# EAGLE design interface2kempston (EAGLE 7.3.0)
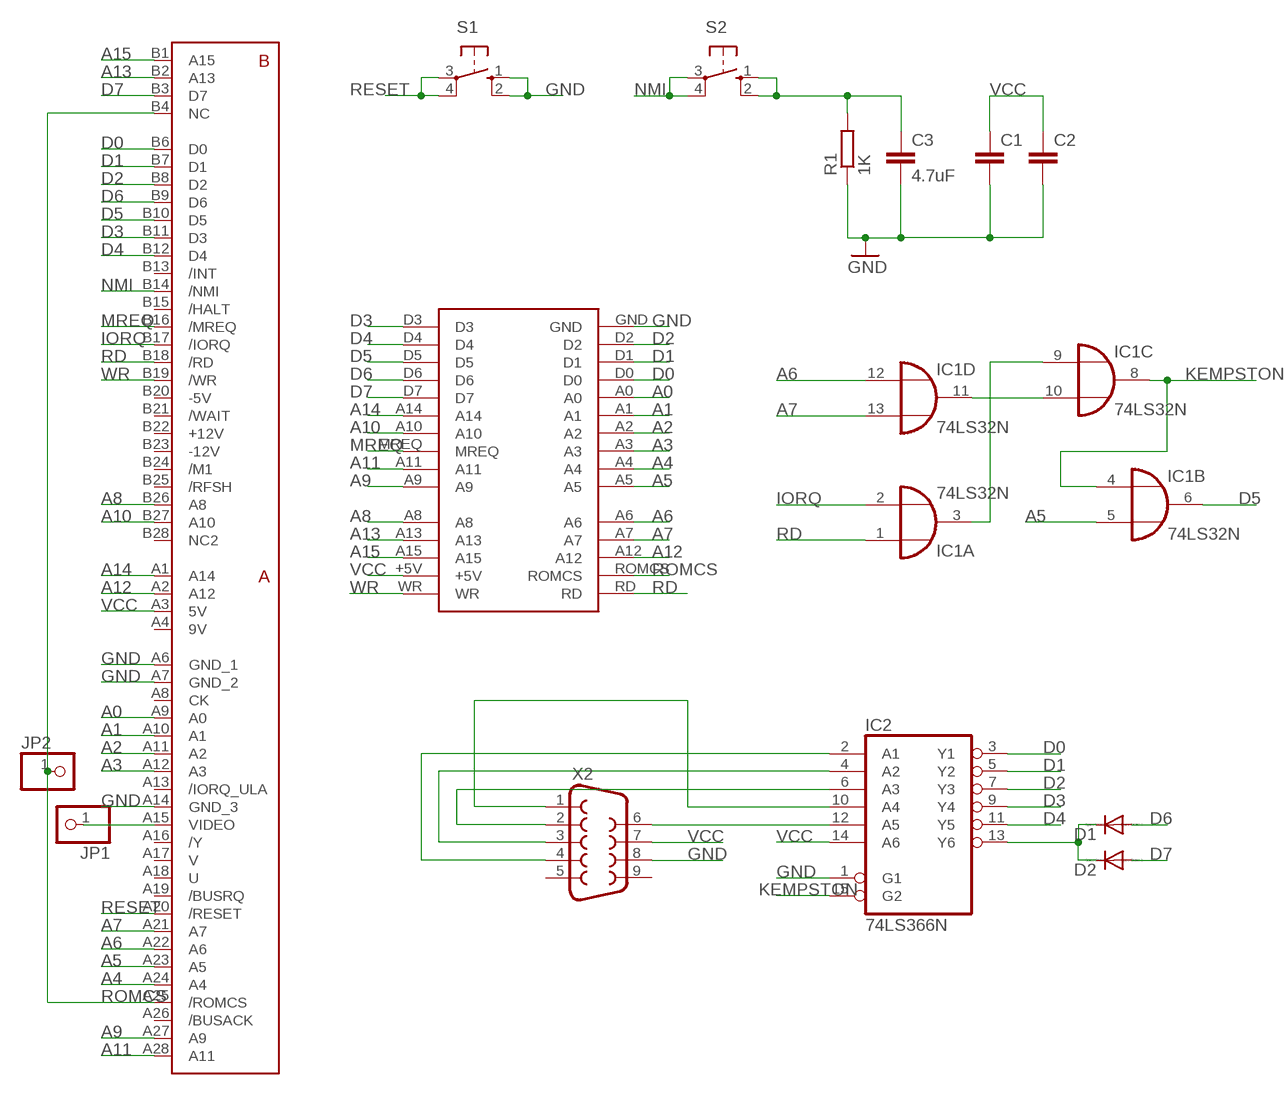
[diagram p0: schematic, sheet 1]

## Parts
C1  C-EUC0603K  [C0603K]
C2  C-EUC0603K  [C0603K]
C3  4.7uF  C-EUC0805  [C0805]
D1  DIODE-SOD323-W  [SOD323-W]
D2  DIODE-SOD323-W  [SOD323-W]
IC1  74LS32N  [DIL14]
IC2  74LS366N  [DIL16]
JP1  PINHD-1X1  [1X01]
JP2  PINHD-1X1  [1X01]
R1  1K  R-EU_R0805  [R0805]
S1  10-XX  [B3F-10XX]
S2  10-XX  [B3F-10XX]
U$1  ZX_CARTRIDGE  [ZX_CARTRIDGE]
U$3  ZXSP_ED2X28_SPE  [2X28_SPE]
X2  DB9MALE  [DB9_MALE]

## Nets
/RDIO: IC1.3(A:O) IC1.9(C:I0)
A0: U$1.A0 U$3.A9(A0)
A1: U$1.A1 U$3.A10(A1)
A2: U$1.A2 U$3.A11(A2)
A3: U$1.A3 U$3.A12(A3)
A4: U$1.A4 U$3.A24(A4)
A5: IC1.5(B:I1) U$1.A5 U$3.A23(A5)
A6: IC1.12(D:I0) U$1.A6 U$3.A22(A6)
A7: IC1.13(D:I1) U$1.A7 U$3.A21(A7)
A8: U$1.A8 U$3.B26(A8)
A9: U$1.A9 U$3.A27(A9)
A10: U$1.A10 U$3.B27(A10)
A11: U$1.A11 U$3.A28(A11)
A12: U$1.A12 U$3.A2(A12)
A13: U$1.A13 U$3.B2(A13)
A14: U$1.A14 U$3.A1(A14)
A15: U$1.A15 U$3.B1(A15)
D0: IC2.3(Y1) U$1.D0 U$3.B6(D0)
D1: IC2.5(Y2) U$1.D1 U$3.B7(D1)
D2: IC2.7(Y3) U$1.D2 U$3.B8(D2)
D3: IC2.9(Y4) U$1.D3 U$3.B11(D3)
D4: IC2.11(Y5) U$1.D4 U$3.B12(D4)
D5: IC1.6(B:O) U$1.D5 U$3.B10(D5)
D6: D1.A U$1.D6 U$3.B9(D6)
D7: D2.A U$1.D7 U$3.B3(D7)
GND: C1.2 C2.2 C3.2 IC2.1(G1) R1.1 S1.1(S) S1.2(S1) U$1.GND U$3.A6(GND_1) U$3.A7(GND_2) U$3.A14(GND_3) X2.8
IORQ: IC1.2(A:I1) U$3.B17(/IORQ)
KEMPSTON: IC1.4(B:I0) IC1.8(C:O) IC2.15(G2)
MREQ: U$1.MREQ U$3.B16(/MREQ)
N$1: JP1.1 U$3.A15(VIDEO)
N$2: IC2.10(A4) X2.1
N$3: D1.C D2.C IC2.13(Y6)
N$4: IC1.10(C:I1) IC1.11(D:O)
N$5: C3.1 R1.2 S2.1(S) S2.2(S1)
N$6: IC2.6(A3) X2.2
N$10: IC2.12(A5) X2.6
N$36: IC2.2(A1) X2.4
N$37: IC2.4(A2) X2.3
NMI: S2.3(P) S2.4(P1) U$3.B14(/NMI)
RD: IC1.1(A:I0) U$1.RD U$3.B18(/RD)
RESET: S1.3(P) S1.4(P1) U$3.A20(/RESET)
ROMCS: JP2.1 U$1.ROMCS U$3.A25(/ROMCS) U$3.B4(NC)
VCC: C1.1 C2.1 IC2.14(A6) U$1.+5V U$3.A3(5V) X2.7
WR: U$1.WR U$3.B19(/WR)
Unconnected: U$3.A8(CK) U$3.A13(/IORQ_ULA) U$3.A16(/Y) U$3.A17(V) U$3.A18(U) U$3.A19(/BUSRQ) U$3.A26(/BUSACK) U$3.B13(/INT) U$3.B15(/HALT) U$3.B21(/WAIT) U$3.B24(/M1) U$3.B25(/RFSH) U$3.B28(NC2) X2.5 X2.9

## Power pins joined to a net without a drawn wire
9V: U$3.A4(9V)
+12V: U$3.B22(+12V)
-5V: U$3.B20(-5V)
-12V: U$3.B23(-12V)
GND: IC1.7(P:GND) IC2.8(GND)
VCC: IC1.14(P:VCC) IC2.16(VCC)

## Library data of the parts
C1 C2 = rcl:C-EU: CAPACITOR, European symbol
C3 = resistor:C-EU: CAPACITOR, European symbol
D1 D2 = diode:DIODE-: DIODE
IC1 = 74xx-eu:74*32: Quad 2-input OR gate
IC2 = 74xx-eu:74*366: Hex BUS DRIVER, 3-state
JP1 JP2 = pinhead:PINHD-1X1: PIN HEADER
R1 = rcl:R-EU_: RESISTOR, European symbol
S1 S2 = switch-omron:10-XX: OMRON SWITCH; MPN: B3F-1000; OC_FARNELL: 176432; OC_NEWARK: 36M3542
U$1 = 8Bit_Parts:ZX_CARTRIDGE
U$3 = zx_edge:ZXSP_ED
X2 = SparkFun-Connectors:DB9: DB9 Connector Standard DB9 (D-Sub 9) serial connector. Can be used for CAN bus as well as RS485 and RS232. Footprint production proven. Spark Fun Electronics SKU : PRT-00429

## Net classes
1 power: width 0.508 mm, clearance 0.254 mm to class 0, clearance 0.254 mm

## Board
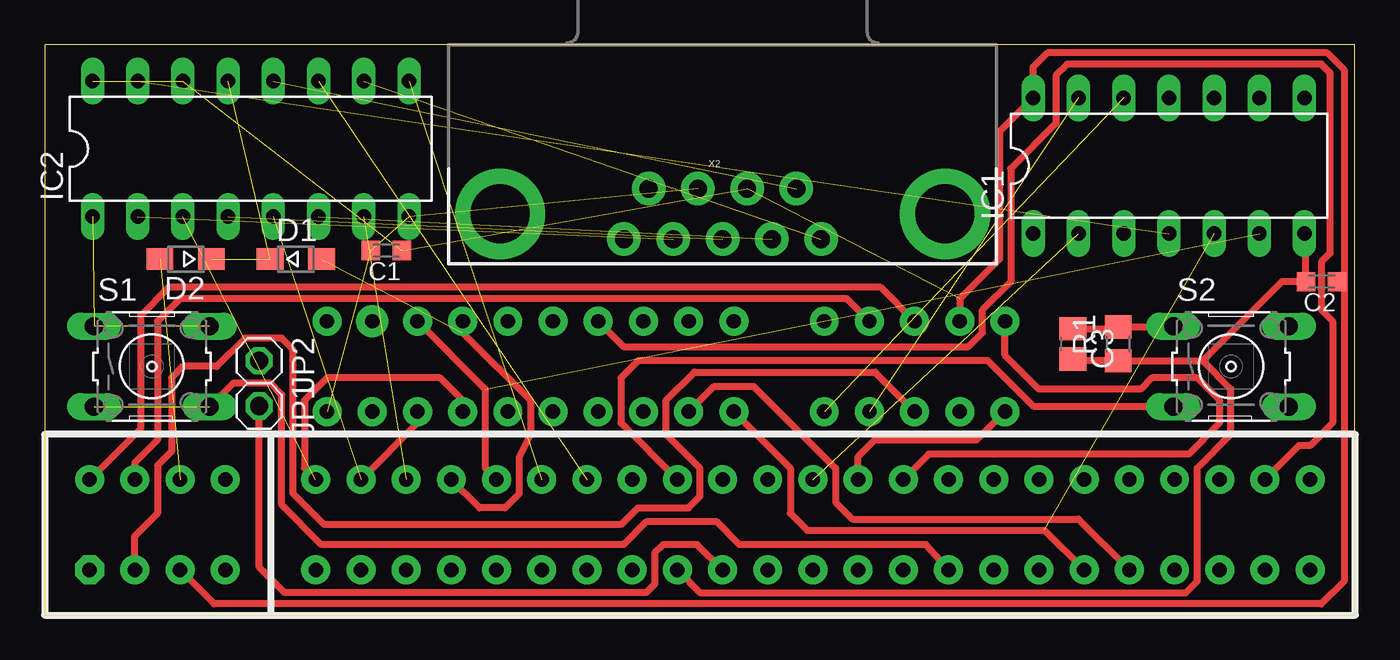
[diagram p1: board, top side]
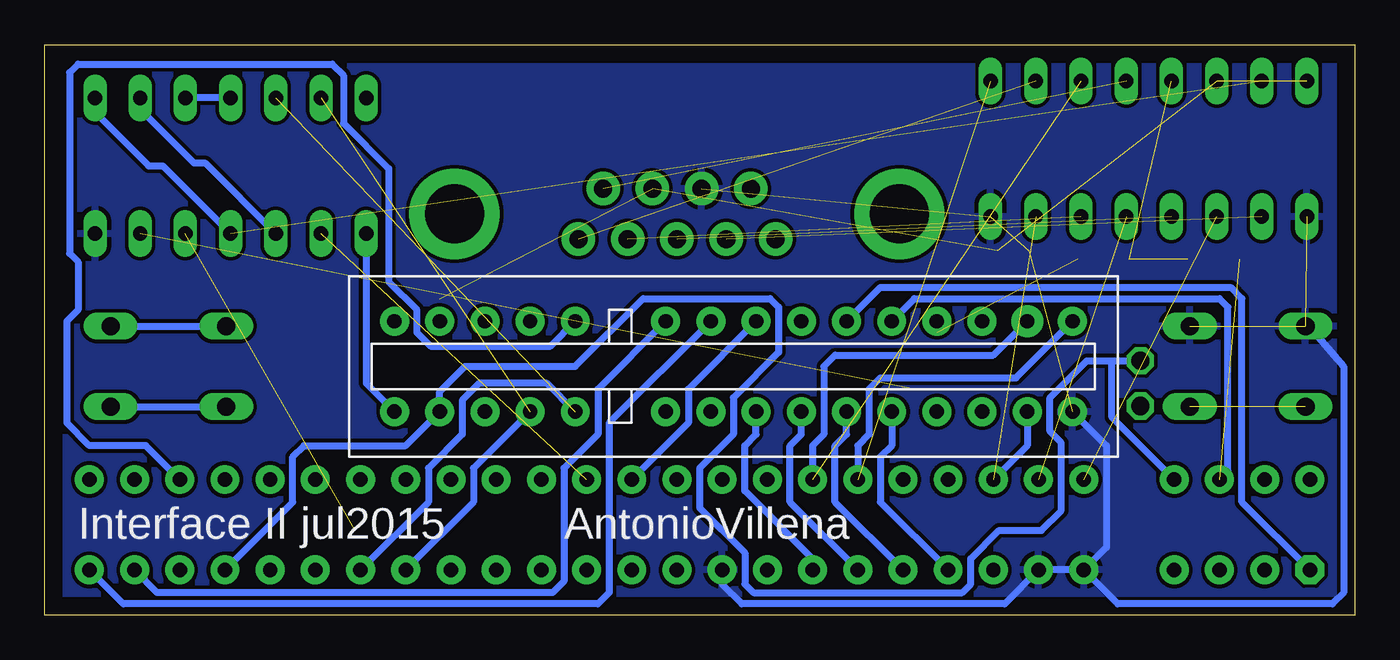
[diagram p2: board, bottom side, seen from below]

Size 73.64 x 32.05 mm. Coordinates in mm from the lower left corner, seen from the top.
Outline: 0,0 73.64,0 73.64,32.05 0,32.05 0,0
Copper layers (1*16): Top 0.035mm / dielectric 1.5mm / Bottom 0.035mm
Design rules "default": minimum track width 10mil, minimum drill 24mil, track to track 8mil, track to pad 8mil, pad to pad 8mil, via to via 8mil, smd to smd 8mil, copper to edge 40mil, drill to drill 8mil, minimum pad ring 10mil, minimum via ring 8mil, stop-mask expansion 4mil, vias tented up to drill 0mil, thermal gap 10mil

### Footprints (pad centres in the part's own frame; a part is rotated, then mirrored left to right if it is on the bottom)
C0603K = smd 1.05 x 1.08: 1 -0.875,0; 2 0.875,0
C0805 = smd 1.3 x 1.5: 1 -0.85,0; 2 0.85,0
SOD323-W = smd 1.5 x 1.2: A 1.45,0; C -1.45,0
DIL14 = drill 0.813 long: 1 -7.62,-3.81; 2 -5.08,-3.81; 3 -2.54,-3.81; 4 0,-3.81; 5 2.54,-3.81; 6 5.08,-3.81; 7 7.62,-3.81; 8 7.62,3.81; 9 5.08,3.81; 10 2.54,3.81; 11 0,3.81; 12 -2.54,3.81; 13 -5.08,3.81; 14 -7.62,3.81
DIL16 = drill 0.813 long: 1 -8.89,-3.81; 2 -6.35,-3.81; 3 -3.81,-3.81; 4 -1.27,-3.81; 5 1.27,-3.81; 6 3.81,-3.81; 7 6.35,-3.81; 8 8.89,-3.81; 9 8.89,3.81; 10 6.35,3.81; 11 3.81,3.81; 12 1.27,3.81; 13 -1.27,3.81; 14 -3.81,3.81; 15 -6.35,3.81; 16 -8.89,3.81
1X01 = drill 1.016 octagon: 1 0,0
R0805 = smd 1.3 x 1.5: 1 -0.95,0; 2 0.95,0
B3F-10XX = drill 1.016 long: 1 -3.251,2.261; 2 3.251,2.261; 3 -3.251,-2.261; 4 3.251,-2.261
ZX_CARTRIDGE = drill 0.813 pad 1.626: +5V 17.78,-2.54; A0 -7.62,2.54; A1 -5.08,2.54; A2 -2.54,2.54; A3 0,2.54; A4 2.54,2.54; A5 5.08,2.54; A6 10.16,2.54; A7 12.7,2.54; A8 10.16,-2.54; A9 5.08,-2.54; A10 -2.54,-2.54; A11 2.54,-2.54; A12 15.24,2.54; A13 12.7,-2.54; A14 -5.08,-2.54; A15 15.24,-2.54; D0 -10.16,2.54; D1 -12.7,2.54; D2 -15.24,2.54; D3 -17.78,-2.54; D5 -12.7,-2.54; D6 -10.16,-2.54; D7 -7.62,-2.54; GND -17.78,2.54; MREQ 0,-2.54; RD 20.32,2.54; ROMCS 17.78,2.54; WR 20.32,-2.54 | drill 0.813 pad 1.788: D4 -15.24,-2.54
2X28_SPE = drill 0.813 pad 1.626 octagon: A1 0,-5.08 | drill 0.813 pad 1.626: A2 2.54,-5.08; A3 5.08,-5.08; A4 7.62,-5.08; A6 12.7,-5.08; A7 15.24,-5.08; A8 17.78,-5.08; A9 20.32,-5.08; A10 22.86,-5.08; A11 25.4,-5.08; A12 27.94,-5.08; A13 30.48,-5.08; A14 33.02,-5.08; A15 35.56,-5.08; A16 38.1,-5.08; A17 40.64,-5.08; A18 43.18,-5.08; A19 45.72,-5.08; A20 48.26,-5.08; A21 50.8,-5.08; A22 53.34,-5.08; A23 55.88,-5.08; A24 58.42,-5.08; A25 60.96,-5.08; A26 63.5,-5.08; A27 66.04,-5.08; A28 68.58,-5.08; B1 0,0; B2 2.54,0; B3 5.08,0; B4 7.62,0; B6 12.7,0; B7 15.24,0; B8 17.78,0; B9 20.32,0; B10 22.86,0; B11 25.4,0; B12 27.94,0; B13 30.48,0; B14 33.02,0; B15 35.56,0; B16 38.1,0; B17 40.64,0; B18 43.18,0; B19 45.72,0; B20 48.26,0; B21 50.8,0; B22 53.34,0; B23 55.88,0; B24 58.42,0; B25 60.96,0; B26 63.5,0; B27 66.04,0; B28 68.58,0
DB9_MALE = drill 1.016 pad 1.88: 1 5.54,-1.42; 2 2.77,-1.42; 3 0,-1.42; 4 -2.77,-1.42; 5 -5.54,-1.42; 6 4.15,1.42; 7 1.38,1.42; 8 -1.38,1.42; 9 -4.15,1.42 | drill 3.302 pad 5.08: G1 -12.5,0; G2 12.5,0

### Placement (x,y rotation side)
C1  19.21,20.48 180 top
C2  71.75,18.73 180 top
C3  57.78,15.24 270 top
D1  14.13,20 0 top
D2  7.94,20 180 top
IC1  63.18,25.24 0 top
IC2  11.59,26.19 0 top
JP1  12.06,11.75 270 top
JP2  12.06,14.29 270 top
R1  60.33,15.24 90 top
S1  6.03,13.97 0 top
S2  66.67,13.97 0 top
U$1  33.66,13.97 180 bottom
U$3  2.54,7.62 0 top
X2  38.1,22.54 0 top

### Tracks (layer width: path | path; a pad name or v marks a point on that pad's centre or on a via)
/RDIO
  Bottom 0.406: IC1.9 68.26,28.42 65.25,25.4 64.61,25.4 IC1.3
A0
  Bottom 0.406: U$3.A9 26.67,6.35 26.67,8.89 26.04,9.53 U$1.A0
A1
  Bottom 0.406: U$3.A10 29.21,6.35 29.21,9.53 28.57,10.16 U$1.A1
A2
  Bottom 0.406: U$3.A11 31.75,6.35 31.75,9.53 31.11,10.16 U$1.A2
A3
  Bottom 0.406: U$1.A3 33.66,10.16 34.29,9.53 34.29,6.99 30.48,3.17 U$3.A12
A4
  Top 0.406: U$1.A4 37.62,12.86 39.85,12.86 44.45,8.26 44.45,6.35 45.4,5.4 58.1,5.4 U$3.A24
A5  (1 unrouted)
  Top 0.406: U$3.A23 56.2,4.76 42.86,4.76 41.91,5.71 41.91,8.26 U$1.A5
A6  (1 unrouted)
  Bottom 0.406: U$1.A6 45.4,13.02 49.21,13.02 50.16,12.06 50.16,10.16 52.07,8.26 52.07,6.35 U$3.A22
A7  (1 unrouted)
  Bottom 0.406: U$1.A7 49.53,8.26 49.53,6.35 U$3.A21
A8
  Bottom 0.406: U$1.A8 45.24,15.08 51.91,15.08 52.7,15.88 52.7,17.14 54.29,18.73 54.29,25.08 56.83,27.62 56.83,30.32 57.47,30.96 71.75,30.96 72.23,30.48 72.23,20.32 71.75,19.84 71.75,17.14 72.39,16.51 72.39,10.79 71.12,9.53 67.94,9.53 U$3.B26
A9
  Bottom 0.406: U$1.A9 42.55,12.7 42.55,10.16 44.45,8.26 44.45,1.91 45.09,1.27 67.31,1.27 U$3.A27
A10
  Top 0.406: U$1.A10 32.54,15.08 51.91,15.08 52.7,15.88 52.7,17.14 54.29,18.73 54.29,25.08 56.83,27.62 56.83,30.32 57.47,30.96 71.75,30.96 72.23,30.48 72.23,20.32 71.75,19.84 71.75,17.14 72.39,16.51 72.39,10.79 71.12,9.53 70.48,9.53 U$3.B27
A11
  Bottom 0.406: U$1.A11 41.91,10.79 41.91,1.27 42.55,0.64 69.22,0.64 U$3.A28
A12
  Top 0.406: U$1.A12 46.67,13.65 36.51,13.65 34.92,12.06 34.92,10.16 36.83,8.26 36.83,6.67 36.2,6.03 33.34,6.03 32.38,5.08 15.72,5.08 13.97,6.83 13.97,14.92 13.34,15.56 11.27,15.56 9.68,13.97 7.78,13.97 7.14,13.34 7.14,9.21 6.35,8.41 6.35,5.71 5.08,4.45 U$3.A2
A13
  Top 0.406: U$1.A13 45.09,17.78 7.62,17.78 6.35,16.51 6.35,9.84 5.08,8.57 U$3.B2
A14
  Bottom 0.406: U$1.A14 26.67,18.41 6.99,18.41 6.35,17.78 6.35,6.35 U$3.A1
A15
  Top 0.406: U$1.A15 46.99,18.41 6.99,18.41 5.4,16.83 5.4,10.48 U$3.B1
D0  (1 unrouted)
  Top 0.406: U$1.D0 23.5,12.06 22.23,13.34 15.88,13.34 14.61,12.06 14.61,8.26 U$3.B6
D1  (1 unrouted)
  Top 0.406: U$1.D1 20.95,10.79 U$3.B7
D2  (1 unrouted)
  Bottom 0.406: U$1.D2 18.41,9.53 U$3.B8
D3  (1 unrouted)
  Bottom 0.406: U$1.D3 19.05,13.34 26.67,13.34 27.3,12.7 27.3,10.16 27.94,9.53 U$3.B11
D4  (1 unrouted)
  Bottom 0.406: U$1.D4 20.32,14.61 29.21,14.61 29.84,13.97 29.84,10.16 30.48,9.53 U$3.B12
D5  (1 unrouted)
  Top 0.406: U$1.D5 24.77,12.7 24.77,8.26 U$3.B10
D6  (1 unrouted)
  Top 0.406: U$1.D6 23.5,15.88 27.3,12.06 27.3,10.16 26.67,8.89 26.67,6.83 25.88,6.03 24.45,6.03 U$3.B9
D7  (1 unrouted)
  Bottom 0.406: U$1.D7 24.77,17.78 7.62,17.78 7.14,17.3 7.14,8.1 U$3.B3
GND  (5 unrouted)
  Top 0.406: C3.2 57.88,14.29 R1.1 65.08,14.29 | U$3.A14 36.83,1.27 64.14,1.27 64.77,1.91 64.77,8.26 66.67,10.16 66.67,12.7 65.08,14.29 | IC1.7 70.88,21.35 C2.2 69.53,18.73 65.08,14.29
  Bottom 0.406: S1.1 2.58,16.23 0.64,13.97 0.64,1.27 1.27,0.64 13.34,0.64 U$3.A6 | U$3.A6 U$3.A7 19.68,0.64 34.45,0.64 35.56,1.75 U$3.A14 | U$1.GND 13.97,9.53 13.97,3.81 U$3.A6
  pour Bottom: 0.32,31.59 73.34,31.59 73.34,0.32 0.32,0.32
IORQ  (1 unrouted)
KEMPSTON  (1 unrouted)
  Bottom 0.406: IC1.8 70.8,28.26 67.79,25.24 66.99,25.24 IC1.4
MREQ
  Bottom 0.406: U$1.MREQ 37.47,12.7 37.47,10.79 U$3.B16
N$1
  Top 0.406: U$3.A15 36.67,3.97 34.77,3.97 34.29,3.49 34.29,1.75 33.81,1.27 13.49,1.27 12.06,2.7 JP1.1
N$2  (1 unrouted)
N$3  (2 unrouted)
N$4
  Bottom 0.406: IC1.11 IC1.10
N$5
  Top 0.406: C3.1 60.23,16.09 R1.2 63.38,16.19 S2.1
  Bottom 0.406: S2.2 S2.1
N$6  (1 unrouted)
N$10  (1 unrouted)
N$36  (1 unrouted)
N$37  (1 unrouted)
NMI
  Top 0.406: S2.3 55.6,11.71 53.02,14.29 33.34,14.29 32.38,13.34 32.38,10.79 U$3.B14
  Bottom 0.406: S2.4 S2.3
RD
  Top 0.406: U$3.B18 45.72,8.89 46.67,9.84 52.39,9.84 U$1.RD
  Bottom 0.406: IC1.1 55.56,13.02 U$1.RD
RESET  (1 unrouted)
  Top 0.406: U$3.A20 49.53,3.97 39.05,3.97 37.78,5.24 33.81,5.24 32.54,3.97 15.56,3.97 13.34,6.19 13.34,12.38 12.7,13.02 10.59,13.02 S1.4
ROMCS
  Bottom 0.406: U$3.A25 59.69,6.35 59.69,8.89 59.05,9.53 53.34,9.53 U$1.ROMCS 51.44,12.54 50.01,13.97 43.81,13.97 40.01,17.78 32.86,17.78 32.38,17.3 32.38,14.76 34.92,12.22 34.92,10.16 36.83,8.26 36.83,6.03 34.29,3.49 34.29,1.75 33.81,1.27 22.07,1.27 21.59,1.75 21.59,3.17 20,4.76 17.62,4.76 16.51,5.87 16.51,9.68 17.14,10.32 17.14,12.22 15.08,14.29 13.65,14.29 | U$3.B4 13.65,11.11 13.65,14.29 | 13.65,14.29 JP2.1
VCC  (4 unrouted)
  Top 0.406: 73.03,18.89 73.03,30.64 72.07,31.59 56.36,31.59 55.56,30.8 IC1.14 53.66,27.15 53.66,20 51.44,17.78 U$1.+5V | 73.03,18.89 73.03,18.57 | 73.03,18.57 73.03,1.91 71.75,0.64 9.53,0.64 U$3.A3 | 72.94,18.81 73.03,18.89 | C2.1 72.87,18.73 73.03,18.57
WR
  Top 0.406: U$1.WR 53.98,14.61 55.88,12.7 61.59,12.7 62.23,13.34 64.77,13.34 66.04,12.06 66.04,10.79 64.29,9.05 49.69,9.05 U$3.B19

### Text on the board
bPlace: AntonioVillena | Interface II jul2015